# EAGLE design 1 (EAGLE 6.5.0)
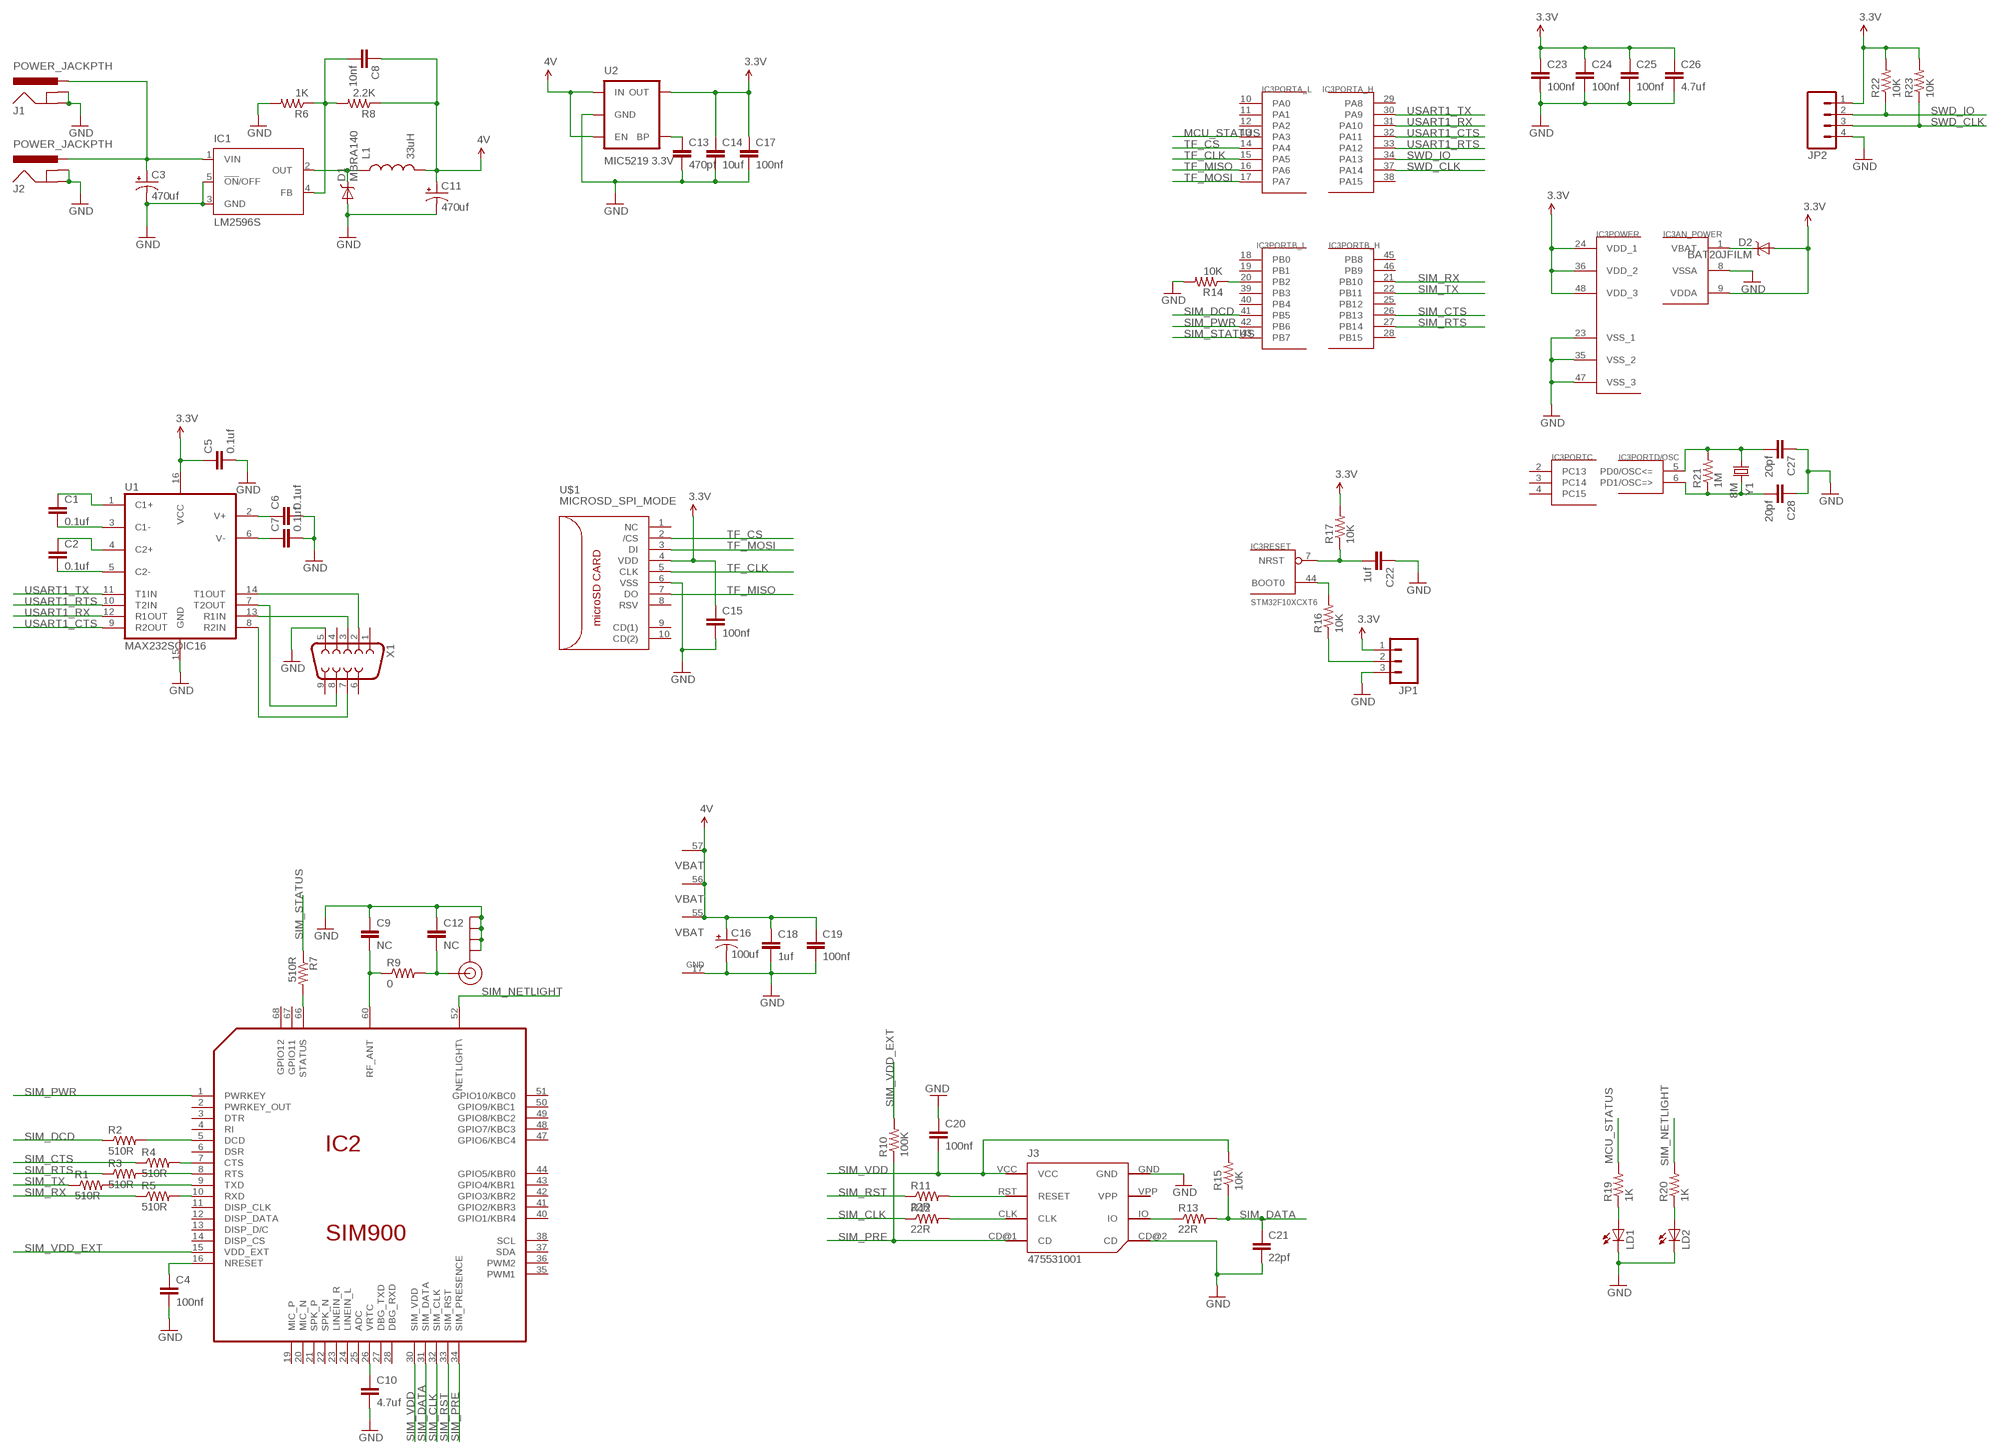
[diagram p0: schematic, sheet 1]

## Parts
C1  0.1uf  CAP0603-CAP  [0603-CAP]
C2  0.1uf  CAP0603-CAP  [0603-CAP]
C3  470uf  CAP_POLG  [PANASONIC_G]
C4  100nf  CAP0603-CAP  [0603-CAP]
C5  0.1uf  CAP0603-CAP  [0603-CAP]
C6  0.1uf  CAP0603-CAP  [0603-CAP]
C7  0.1uf  CAP0603-CAP  [0603-CAP]
C8  10nf  CAP0603-CAP  [0603-CAP]
C9  NC  CAP0603-CAP  [0603-CAP]
C10  4.7uf  CAP0603-CAP  [0603-CAP]
C11  470uf  CAP_POLG  [PANASONIC_G]
C12  NC  CAP0603-CAP  [0603-CAP]
C13  470pf  CAP0603-CAP  [0603-CAP]
C14  10uf  CAP0603-CAP  [0603-CAP]
C15  100nf  CAP0603-CAP  [0603-CAP]
C16  100uf  CAP_POL6032  [EIA6032]
C17  100nf  CAP0603-CAP  [0603-CAP]
C18  1uf  CAP0603-CAP  [0603-CAP]
C19  100nf  CAP0603-CAP  [0603-CAP]
C20  100nf  CAP0603-CAP  [0603-CAP]
C21  22pf  CAP0603-CAP  [0603-CAP]
C22  1uf  CAP0603-CAP  [0603-CAP]
C23  100nf  CAP0603-CAP  [0603-CAP]
C24  100nf  CAP0603-CAP  [0603-CAP]
C25  100nf  CAP0603-CAP  [0603-CAP]
C26  4.7uf  CAP0603-CAP  [0603-CAP]
C27  20pf  CAP0603-CAP  [0603-CAP]
C28  20pf  CAP0603-CAP  [0603-CAP]
D1  MBRA140  [SMA-DIODE]
D2  BAT20JFILM  [SOD-323]
IC1  LM2596S  [TO263-5]
IC2  SIM900  [SIM900]
IC3  STM32F10XCXT6  [TQFP48]
J1  POWER_JACKPTH  [POWER_JACK_PTH]
J2  POWER_JACKPTH  [POWER_JACK_PTH]
J3  475531001  [475531001]
J$1  SMA_EDGE  [SMA-EDGE]
JP1  M03PTH  [1X03]
JP2  M04PTH  [1X04]
L1  33uH  INDUCTOR68UH-1A  [CR75]
LD1  LEDCHIP-LED0805  [CHIP-LED0805]
LD2  LEDCHIP-LED0805  [CHIP-LED0805]
R1  510R  RESISTOR0603-RES  [0603-RES]
R2  510R  RESISTOR0603-RES  [0603-RES]
R3  510R  RESISTOR0603-RES  [0603-RES]
R4  510R  RESISTOR0603-RES  [0603-RES]
R5  510R  RESISTOR0603-RES  [0603-RES]
R6  1K  RESISTOR0603-RES  [0603-RES]
R7  510R  RESISTOR0603-RES  [0603-RES]
R8  2.2K  RESISTOR0603-RES  [0603-RES]
R9  0  1M-1%  [0603-RES]
R10  100K  1M-1%  [0603-RES]
R11  22R  1M-1%  [0603-RES]
R12  22R  1M-1%  [0603-RES]
R13  22R  1M-1%  [0603-RES]
R14  10K  1M-1%  [0603-RES]
R15  10K  1M-1%  [0603-RES]
R16  10K  RESISTOR0603-RES  [0603-RES]
R17  10K  RESISTOR0603-RES  [0603-RES]
R19  1K  RESISTOR0603-RES  [0603-RES]
R20  1K  RESISTOR0603-RES  [0603-RES]
R21  1M  1M-1%  [0603-RES]
R22  10K  1M-1%  [0603-RES]
R23  10K  1M-1%  [0603-RES]
U1  MAX232SOIC16  [SO016]
U2  MIC5219 3.3V  V_REG_MIC52193.3V  [SOT23-5]
U$1  MICROSD_SPI_MODE  [MICRO_SD_CONNECTOR]
X1  DB9FEMALE  [DB9]
Y1  8M  CRYSTALHC49US  [HC49US]

## Nets
3.3V: C5.1 C14.1 C15.1 C17.1 C23.1 C24.1 C25.1 C26.1 D2.2(A) IC3.9(AN_POWER:VDDA) IC3.24(POWER:VDD_1) IC3.36(POWER:VDD_2) IC3.48(POWER:VDD_3) JP1.1 JP2.1 R17.2 R22.2 R23.2 U1.16(VCC) U2.5(OUT) U$1.4(VDD)
GND: C3.- C4.2 C5.2 C6.2 C7.2 C9.1 C10.2 C11.- C12.1 C13.2 C14.2 C15.2 C16.P$2(-) C17.2 C18.2 C19.2 C20.1 C21.2 C22.1 C23.2 C24.2 C25.2 C26.2 C27.1 C28.1 D1.A IC1.3(GND) IC1.5(!ON!/OFF) IC2.17(GND) IC3.8(AN_POWER:VSSA) IC3.23(POWER:VSS_1) IC3.35(POWER:VSS_2) IC3.47(POWER:VSS_3) J1.GND J1.GNDBREAK J2.GND J2.GNDBREAK J3.CD@2(CD) J3.GND J$1.GND@0(GND) J$1.GND@1(GND) J$1.GND@2(GND) J$1.GND@3(GND) JP1.3 JP2.4 LD1.C LD2.C R6.2 R14.2 U1.15(GND) U2.2(GND) U$1.6(VSS) X1.5
MCU_STATUS: IC3.13(PORTA_L:PA3) R19.2
N$1: D2.1(C) IC3.1(AN_POWER:VBAT)
N$2: C27.2 IC3.5(PORTD/OSC:PD0/OSC<=) R21.2 Y1.1
N$3: C28.2 IC3.6(PORTD/OSC:PD1/OSC=>) R21.1 Y1.2
N$4: C22.2 IC3.7(RESET:NRST) R17.1
N$5: IC3.44(RESET:BOOT0) R16.2
N$6: JP1.2 R16.1
N$7: C3.+ IC1.1(VIN) J1.PWR J2.PWR
N$8: D1.C IC1.2(OUT) L1.P$1
N$9: C2.2 U1.5(C2-)
N$10: C1.2 U1.3(C1-)
N$11: C8.2 IC1.4(FB) R6.1 R8.2
N$12: C13.1 U2.4(BP)
N$13: C1.1 U1.1(C1+)
N$14: C2.1 U1.4(C2+)
N$15: C6.1 U1.2(V+)
N$16: C7.1 U1.6(V-)
N$17: IC3.20(PORTB_L:PB2) R14.1
N$18: U1.13(R1IN) X1.3
N$19: U1.14(T1OUT) X1.2
N$20: C9.2 IC2.60(RF_ANT) R9.1
N$21: C12.2 J$1.SIG(SIGNAL) R9.2
N$22: U1.7(T2OUT) X1.8
N$23: U1.8(R2IN) X1.7
N$24: J3.RST(RESET) R11.2
N$25: C10.1 IC2.26(VRTC)
N$26: LD1.A R19.1
N$27: LD2.A R20.1
N$29: C4.1 IC2.16(NRESET)
N$30: IC2.7(CTS) R4.2
N$33: IC2.8(RTS) R3.2
N$34: IC2.9(TXD) R1.2
N$35: J3.IO R13.1
N$36: IC2.10(RXD) R5.2
N$37: IC2.5(DCD) R2.2
N$38: IC2.66(STATUS) R7.2
N$39: J3.CLK R12.2
SIM_CLK: IC2.32(SIM_CLK) R12.1
SIM_CTS: IC3.26(PORTB_H:PB13) R4.1
SIM_DATA: C21.1 IC2.31(SIM_DATA) R13.2 R15.1
SIM_DCD: IC3.41(PORTB_L:PB5) R2.1
SIM_NETLIGHT: IC2.52(NETLIGHT\) R20.2
SIM_PRE: IC2.34(SIM_PRESENCE) J3.CD@1(CD) R10.1
SIM_PWR: IC2.1(PWRKEY) IC3.42(PORTB_L:PB6)
SIM_RST: IC2.33(SIM_RST) R11.1
SIM_RTS: IC3.27(PORTB_H:PB14) R3.1
SIM_RX: IC3.21(PORTB_H:PB10) R5.1
SIM_STATUS: IC3.43(PORTB_L:PB7) R7.1
SIM_TX: IC3.22(PORTB_H:PB11) R1.1
SIM_VDD: C20.2 IC2.30(SIM_VDD) J3.VCC R15.2
SIM_VDD_EXT: IC2.15(VDD_EXT) R10.2
SWD_CLK: IC3.37(PORTA_H:PA14) JP2.3 R23.1
SWD_IO: IC3.34(PORTA_H:PA13) JP2.2 R22.1
TF_CLK: IC3.15(PORTA_L:PA5) U$1.5(CLK)
TF_CS: IC3.14(PORTA_L:PA4) U$1.2(/CS)
TF_MISO: IC3.16(PORTA_L:PA6) U$1.7(DO)
TF_MOSI: IC3.17(PORTA_L:PA7) U$1.3(DI)
USART1_CTS: IC3.32(PORTA_H:PA11) U1.9(R2OUT)
USART1_RTS: IC3.33(PORTA_H:PA12) U1.10(T2IN)
USART1_RX: IC3.31(PORTA_H:PA10) U1.12(R1OUT)
USART1_TX: IC3.30(PORTA_H:PA9) U1.11(T1IN)
VCC: C8.1 C11.+ C16.P$1(+) C18.1 C19.1 IC2.55(VBAT) IC2.56(VBAT) IC2.57(VBAT) L1.P$2 R8.1 U2.1(IN) U2.3(EN) ; supply symbol labelled 4V
Unconnected: IC2.2(PWRKEY_OUT) IC2.3(DTR) IC2.4(RI) IC2.6(DSR) IC2.11(DISP_CLK) IC2.12(DISP_DATA) IC2.13(DISP_D/C) IC2.14(DISP_CS) IC2.19(MIC_P) IC2.20(MIC_N) IC2.21(SPK_P) IC2.22(SPK_N) IC2.23(LINEIN_R) IC2.24(LINEIN_L) IC2.25(ADC) IC2.27(DBG_TXD) IC2.28(DBG_RXD) IC2.35(PWM1) IC2.36(PWM2) IC2.37(SDA) IC2.38(SCL) IC2.40(GPIO1/KBR4) IC2.41(GPIO2/KBR3) IC2.42(GPIO3/KBR2) IC2.43(GPIO4/KBR1) IC2.44(GPIO5/KBR0) IC2.47(GPIO6/KBC4) IC2.48(GPIO7/KBC3) IC2.49(GPIO8/KBC2) IC2.50(GPIO9/KBC1) IC2.51(GPIO10/KBC0) IC2.67(GPIO11) IC2.68(GPIO12) IC3.2(PORTC:PC13) IC3.3(PORTC:PC14) IC3.4(PORTC:PC15) IC3.10(PORTA_L:PA0) IC3.11(PORTA_L:PA1) IC3.12(PORTA_L:PA2) IC3.18(PORTB_L:PB0) IC3.19(PORTB_L:PB1) IC3.25(PORTB_H:PB12) IC3.28(PORTB_H:PB15) IC3.29(PORTA_H:PA8) IC3.38(PORTA_H:PA15) IC3.39(PORTB_L:PB3) IC3.40(PORTB_L:PB4) IC3.45(PORTB_H:PB8) IC3.46(PORTB_H:PB9) J3.VPP U$1.1(NC) U$1.8(RSV) U$1.9(CD(1)) U$1.10(CD(2)) X1.1 X1.4 X1.6 X1.9

## Power pins joined to a net without a drawn wire
GND: IC2.18(GND) IC2.29(GND) IC2.39(GND) IC2.45(GND) IC2.46(GND) IC2.53(GND) IC2.54(GND) IC2.58(GND) IC2.59(GND) IC2.61(GND) IC2.62(GND) IC2.63(GND) IC2.64(GND) IC2.65(GND)

## Library data of the parts
C1 C2 C4-C10 C12-C15 C17-C28 = SparkFun-Passives:CAP: Capacitor Standard 0603 ceramic capacitor, and 0.1" leaded capacitor.
C3 C11 = SparkFun-Capacitors:CAP_POL: Capacitor Polarized These are standard SMD and PTH capacitors. Normally 10uF, 47uF, and 100uF in electrolytic and tantalum varieties. Always verify the external diameter of the through hole cap, it varies with capacity, voltage, and manufacturer. The EIA devices should be standard.
C16 = SparkFun-Passives:CAP_POL: Capacitor Polarized These are standard SMD and PTH capacitors. Normally 10uF, 47uF, and 100uF in electrolytic and tantalum varieties. Always verify the external diameter of the through hole cap, it varies with capacity, voltage, and manufacturer. The EIA devices should be standard.
D1 = SparkFun-DiscreteSemi:MBRA140: 40V, 1A Schottky rectifier SMA/DO-214AC package DIO-08053; PROD_ID: DIO-08053
D2 = SparkFun-DiscreteSemi:BAT20JFILM: 23V, 1A Schottky diode, SOD-323 package; PROD_ID: DIO-11623
IC1 = national-semiconductor:LM2596: SIMPLE SWITCHER® Power Converter 150 kHz 3A Step-Down Voltage Regulator Source: http://www.national.com/ds/LM/LM2596.pdf
IC2 = sim900:SIM900
IC3 = stm32:STM32F10XCXT6: ST STM32F101/103 48pin LQFP
J1 J2 = SparkFun-Connectors:POWER_JACK: Power Jack This is the standard 5.5mm barrel jack for power. The PTH is the most common, proven, reliable, footprint. The Slot footprint only works if the mill layer is transmitted to the PCB fab house so be warned. Mating wall wart : TOL-00298 (and others); PROD_ID: PRT-00119
J3 = simcard:475531001: MOLEX SIM Card Holder 47553-1001 1.27mm Pitch SIM Card Holder with 2 Detect Pins, 6 Circuits, Push-Push Style, Housing Height 1.80mm, with Pegs, Lead-Free
J$1 = SparkFun-Connectors:SMA_EDGE: SMA Antenna Connector End launch SMA connector. The paste layer has been removed so that the connector can be hand soldered onto the board after reflow.
JP1 = SparkFun-Connectors:M03: Header 3 Standard 3-pin 0.1" header. Use with straight break away headers (SKU : PRT-00116), right angle break away headers (PRT-00553), swiss pins (PRT-00743), machine pins (PRT-00117), and female headers (PRT-00115). Molex polarized connector foot print use with SKU : PRT-08232 with associated crimp pins and housings.
JP2 = SparkFun-Connectors:M04: Header 4 Standard 4-pin 0.1" header. Use with straight break away headers (SKU : PRT-00116), right angle break away headers (PRT-00553), swiss pins (PRT-00743), machine pins (PRT-00117), and female headers (PRT-00115). Molex polarized connector foot print use with SKU : PRT-08231 with associated crimp pins and housings. 1MM SMD Version SKU: PRT-10208
L1 = SparkFun-Passives:INDUCTOR: Inductors Basic Inductor/Choke - 0603 and 1206. Footprints are not proven and vary greatly between part numbers. SRN6045- 33uH, 20% 1.4A SDR0403-560KL - 56uH, 10%, 500mA RMS/740mA peak; PROD_ID: NDUC-09739; VALUE: 68uH
LD1 LD2 = led:LED: LED OSRAM: - CHIPLED LG R971, LG N971, LY N971, LG Q971, LY Q971, LO R971, LY R971 LH N974, LH R974 LS Q976, LO Q976, LY Q976 LO Q996 - Hyper CHIPLED LW Q18S LB Q993, LB Q99A, LB R99A - SideLED LS A670, LO A670, LY A670, LG A670, LP A670 LB A673, LV A673, LT A673, LW A673 LH A674 LY A675 LS A676, LA A676, LO A676, LY A676, LW A676 LS A679, LY A679, LG A679 - Hyper Micro SIDELED® LS Y876, LA Y876, LO Y876, LY Y876 LT Y87S - SmartLED LW L88C, LW L88S LB L89C, LB L89S, LG L890 LS L89K, LO L89K, LY L89K LS L896, LA L896, LO L896, LY L896 - TOPLED LS T670, LO T670, LY T670, LG T670, LP T670 LSG T670, LSP T670, LSY T670, LOP T670, LYG T670 LG T671, LOG T671, LSG T671 LB T673, LV T673, LT T673, LW T673 LH T674 LS T676, LA T676, LO T676, LY T676, LB T676, LH T676, LSB T676, LW T676 LB T67C, LV T67C, LT T67C, LS T67K, LO T67K, LY T67K, LW E67C LS E67B, LA E67B, LO E67B, LY E67B, LB E67C, LV E67C, LT E67C LW T67C LS T679, LY T679, LG T679 LS T770, LO T770, LY T770, LG T770, LP T770 LB T773, LV T773, LT T773, LW T773 LH T774 LS E675, LA E675, LY E675, LS T675 LS T776, LA T776, LO T776, LY T776, LB T776 LHGB T686 LT T68C, LB T68C - Hyper Mini TOPLED® LB M676 - Mini TOPLED Santana® LG M470 LS M47K, LO M47K, LY M47K Source: http://www.osram.convergy.de/
R1-R8 R16 R17 R19 R20 = SparkFun-Passives:RESISTOR: Resistor Basic schematic elements and footprints for 0603, 1206, and PTH resistors.
R9-R15 R22 R23 = SparkFun-Resistors:1M-1%: 1M-ohm SMT 1/10W - 1% (0603) RES-07868; PROD_ID: RES-07868; VALUE: 1M
R21 = SparkFun-Resistors:1M-1%: 1M-ohm SMT 1/10W - 1% (0603) RES-07868; PROD_ID: RES-07868
U1 = SparkFun-DigitalIC:MAX232: RS232 Transceiver Very common IC. This is generically called 'MAX232', but works with the 3V equivalent MAX3232 generic ICs. Field tested and mother approved. Spark Fun Electronics SKU : COM-00316 (DIP) and COM-00589 (SMD)
U2 = SparkFun-PowerIC:V_REG_MIC5219: V_REG MIC5219 Standard 3.3V and 5V 500mA LDO voltage regulator in SOT-23 layout. Micrel part MIC5219. BP (by-pass) pin is used to lower output noise with 470pF cap, may be left open.; PROD_ID: VREG-09872
U$1 = con-molex-microsd:MICROSD_SPI_MODE: MOLEX - 49225-0821 - CONNECTEUR MICRO SD PUSH/PUSH REV Fabricant: MOLEX Code commande Farnell: 1366700 <http://fr.farnell.com/molex/49225-0821/connecteur-micro-sd-push-push-rev/dp/1366700?Ntt=1366700> Référence fabricant: 49225-0821
X1 = SparkFun-Connectors:DB9: DB9 Connector Standard DB9 (D-Sub 9) serial connector. Can be used for CAN bus as well as RS485 and RS232. Footprint production proven. Spark Fun Electronics SKU : PRT-00429
Y1 = SparkFun-FreqCtrl:CRYSTAL: Various standard crystals. Proven footprints. Spark Fun Electronics SKU : COM-00534

## Board
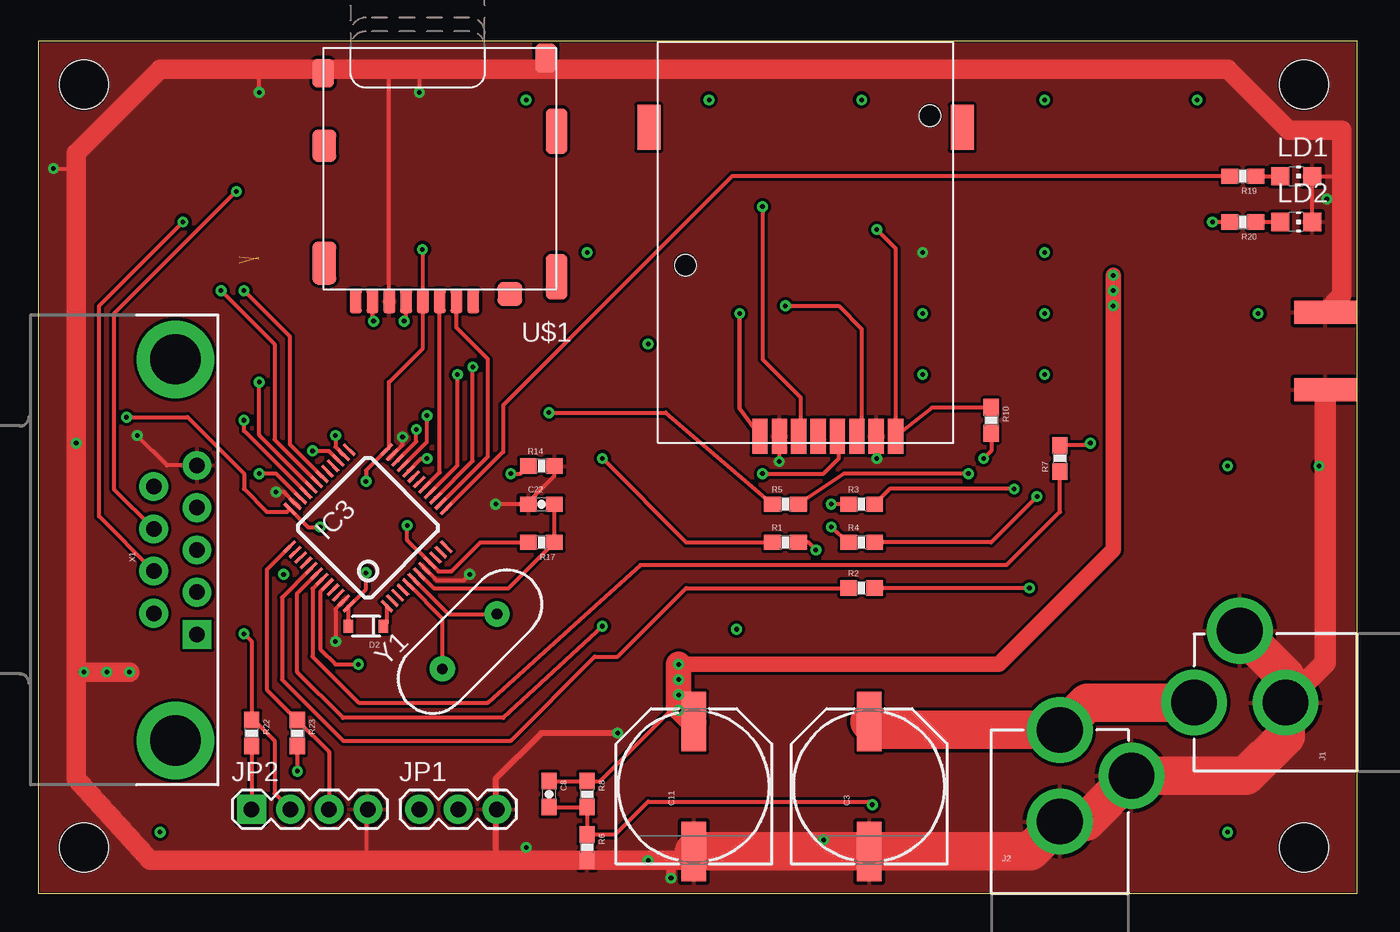
[diagram p1: board, top side]
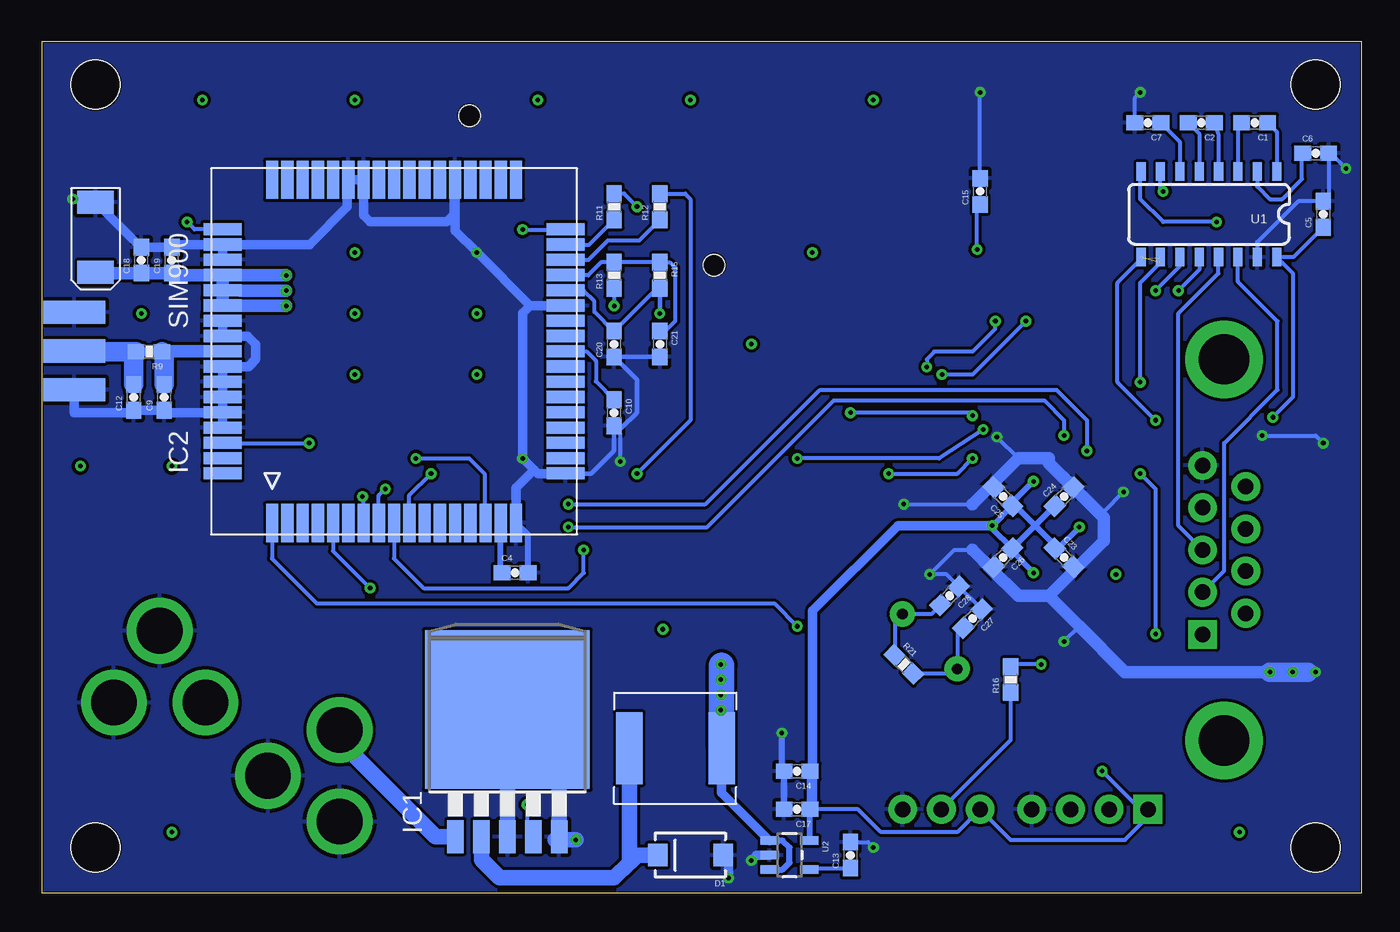
[diagram p2: board, bottom side, seen from below]

Size 86.5 x 55.83 mm. Coordinates in mm from the lower left corner, seen from the top.
Outline: 0,0 86.5,0 86.5,55.83 0,55.83 0,0
Copper layers (1*16): Top 0.035mm / dielectric 1.5mm / Bottom 0.035mm
Design rules "default *": minimum track width 10mil, minimum drill 14mil, track to track 8mil, track to pad 8mil, pad to pad 8mil, via to via 8mil, smd to smd 8mil, copper to edge 0.1mm, drill to drill 8mil, minimum pad ring 10mil, minimum via ring 8mil, stop-mask expansion 4mil, vias tented up to drill 0mil, thermal gap 10mil
Holes 3.2 mm at 83,3 83,53 3,53 3,3

### Footprints (pad centres in the part's own frame; a part is rotated, then mirrored left to right if it is on the bottom)
0603-CAP = smd 1.1 x 1: 1 -0.85,0; 2 0.85,0
PANASONIC_G = smd 3.9 x 1.6: + 4.25,0; - -4.25,0
EIA6032 = smd 1.5 x 2.4: P$1 -2.3,0; P$2 2.3,0
SMA-DIODE = smd 1.27 x 1.47: A -2.15,0; C 2.15,0
SOD-323 = smd 0.63 x 0.83: 1 -1.15,0; 2 1.15,0
TO263-5 = smd 1.067 x 2.159: 1 -3.404,-5.791; 2 -1.702,-5.791; 3 0,-5.791; 4 1.702,-5.791; 5 3.404,-5.791 | smd 10.8 x 10.41: 6 0,2.54
SIM900 = smd 2.5 x 0.8: 1 -11.25,8; 2 -11.25,7; 3 -11.25,6; 4 -11.25,5; 5 -11.25,4; 6 -11.25,3; 7 -11.25,2; 8 -11.25,1; 9 -11.25,0; 10 -11.25,-1; 11 -11.25,-2; 12 -11.25,-3; 13 -11.25,-4; 14 -11.25,-5; 15 -11.25,-6; 16 -11.25,-7; 17 -11.25,-8; 35 11.25,-8; 36 11.25,-7; 37 11.25,-6; 38 11.25,-5; 39 11.25,-4; 40 11.25,-3; 41 11.25,-2; 42 11.25,-1; 43 11.25,0; 44 11.25,1; 45 11.25,2; 46 11.25,3; 47 11.25,4; 48 11.25,5; 49 11.25,6; 50 11.25,7; 51 11.25,8 | smd 0.8 x 2.5: 18 -8,-11.25; 19 -7,-11.25; 20 -6,-11.25; 21 -5,-11.25; 22 -4,-11.25; 23 -3,-11.25; 24 -2,-11.25; 25 -1,-11.25; 26 0,-11.25; 27 1,-11.25; 28 2,-11.25; 29 3,-11.25; 30 4,-11.25; 31 5,-11.25; 32 6,-11.25; 33 7,-11.25; 34 8,-11.25; 52 8,11.25; 53 7,11.25; 54 6,11.25; 55 5,11.25; 56 4,11.25; 57 3,11.25; 58 2,11.25; 59 1,11.25; 60 0,11.25; 61 -1,11.25; 62 -2,11.25; 63 -3,11.25; 64 -4,11.25; 65 -5,11.25; 66 -6,11.25; 67 -7,11.25; 68 -8,11.25
TQFP48 = smd 0.2 x 1: 1 -2.75,-4.5; 2 -2.25,-4.5; 3 -1.75,-4.5; 4 -1.25,-4.5; 5 -0.75,-4.5; 6 -0.25,-4.5; 7 0.25,-4.5; 8 0.75,-4.5; 9 1.25,-4.5; 10 1.75,-4.5; 11 2.25,-4.5; 12 2.75,-4.5; 25 2.75,4.5; 26 2.25,4.5; 27 1.75,4.5; 28 1.25,4.5; 29 0.75,4.5; 30 0.25,4.5; 31 -0.25,4.5; 32 -0.75,4.5; 33 -1.25,4.5; 34 -1.75,4.5; 35 -2.25,4.5; 36 -2.75,4.5 | smd 1 x 0.2: 13 4.5,-2.75; 14 4.5,-2.25; 15 4.5,-1.75; 16 4.5,-1.25; 17 4.5,-0.75; 18 4.5,-0.25; 19 4.5,0.25; 20 4.5,0.75; 21 4.5,1.25; 22 4.5,1.75; 23 4.5,2.25; 24 4.5,2.75; 37 -4.5,2.75; 38 -4.5,2.25; 39 -4.5,1.75; 40 -4.5,1.25; 41 -4.5,0.75; 42 -4.5,0.25; 43 -4.5,-0.25; 44 -4.5,-0.75; 45 -4.5,-1.25; 46 -4.5,-1.75; 47 -4.5,-2.25; 48 -4.5,-2.75
POWER_JACK_PTH = drill 2.997 pad 4.318: GND 0,7.7; GNDBREAK 4.7,10.7; PWR 0,13.7
475531001 = smd 2.3 x 1: CD@1 0.45,3.77; CD@2 0.45,5.04; CLK 0.45,7.58; GND 0.45,11.39; IO 0.45,6.31; RST 0.45,10.12; VCC 0.45,12.66; VPP 0.45,8.85 | smd 2.95 x 1.5: P$9 20.7,-0.6; P$10 20.7,19.95 | hole 1.4: 11.67,17.56; 21.47,1.51
SMA-EDGE = smd 1.524 x 4.064: GND@0 0,0; GND@1 5.08,0; SIG 2.54,0 | smd 1.524 x 4.064 bottom: GND@2 0,0; GND@3 5.08,0
1X03 = drill 1.016 pad 1.88: 1 0,0; 2 2.54,0; 3 5.08,0
1X04 = drill 1.016 pad 1.88 square: 1 0,0 | drill 1.016 pad 1.88: 2 2.54,0; 3 5.08,0; 4 7.62,0
CR75 = smd 1.75 x 4.7: P$1 0,0; P$2 6.05,0
CHIP-LED0805 = smd 1.2 x 1.2: A 0,-1.05; C 0,1.05
0603-RES = smd 1.1 x 1: 1 -0.85,0; 2 0.85,0
SO016 = smd 0.6 x 1.2: 1 -4.445,-2.8; 2 -3.175,-2.8; 3 -1.905,-2.8; 4 -0.635,-2.8; 5 0.635,-2.8; 6 1.905,-2.8; 7 3.175,-2.8; 8 4.445,-2.8; 9 4.445,2.8; 10 3.175,2.8; 11 1.905,2.8; 12 0.635,2.8; 13 -0.635,2.8; 14 -1.905,2.8; 15 -3.175,2.8; 16 -4.445,2.8
SOT23-5 = smd 0.55 x 1.2: 1 -0.95,-1.3; 2 0,-1.3; 3 0.95,-1.3; 4 0.95,1.3; 5 -0.95,1.3
MICRO_SD_CONNECTOR = smd 0.8 x 1.6: 1 -2.03,8.2; 2 -0.93,8.2; 3 0.17,8.2; 4 1.27,8.2; 5 2.37,8.2; 6 3.47,8.2; 7 4.57,8.2; 8 5.67,8.2 | smd 1.55 x 2.8: 9 7.735,5.7 | smd 1.55 x 2.1: 10 7.735,-2 | smd 1.4 x 1.9: 11 7.81,-6.75; 12 -6.79,-7.75 | smd 1.4 x 3: 13 -7.49,-2.95; 14 -7.49,6.6 | smd 1.6 x 1.55: 15 -4.43,7.725
DB9 = drill 1.016 pad 1.88 square: 1 -5.54,-1.42 | drill 1.016 pad 1.88: 2 -2.77,-1.42; 3 0,-1.42; 4 2.77,-1.42; 5 5.54,-1.42; 6 -4.15,1.42; 7 -1.38,1.42; 8 1.38,1.42; 9 4.15,1.42 | drill 3.302 pad 5.08: G1 -12.5,0; G2 12.5,0
HC49US = drill 0.7 pad 1.651: 1 -2.54,0; 2 2.54,0

### Placement (x,y rotation side)
C1  7,50.5 180 bottom
C2  10.5,50.5 180 bottom
C3  54.5,7 90 top
C4  55.5,21 0 bottom
C5  2.5,44.5 90 bottom
C6  3,48.5 0 bottom
C7  14,50.5 180 bottom
C8  33.5,6.5 270 top
C9  78.5,32.5 90 bottom
C10  49,31.5 270 bottom
C11  43,7 90 top
C12  80.5,32.5 90 bottom
C13  33.5,2.5 90 bottom
C14  37,8 180 bottom
C15  25,46 90 bottom
C16  83,43 90 bottom
C17  37,5.5 180 bottom
C18  80,41.5 90 bottom
C19  78,41.5 90 bottom
C20  49,36 90 bottom
C21  46,36 270 bottom
C22  33,25.5 0 top
C23  19.5,22 315 bottom
C24  19.5,26 45 bottom
C25  23.5,26 135 bottom
C26  23.5,22 225 bottom
C27  25.5,18 225 bottom
C28  27,19.5 225 bottom
D1  44,2.5 180 bottom
D2  21.5,17.5 180 top
IC1  56,9.5 0 bottom
IC2  63.43,35.52 90 bottom
IC3  21.63,23.95 45 top
J1  89.5,12.5 90 top
J2  67,-3 0 top
J3  60,29.5 90 top
J$1  84.4,33 90 bottom
JP1  25,5.5 0 top
JP2  14,5.5 0 top
L1  48,9.5 0 bottom
LD1  82.5,47 270 top
LD2  82.5,44 270 top
R1  49,23 0 top
R2  54,20 0 top
R3  54,25.5 0 top
R4  54,23 0 top
R5  49,25.5 0 top
R6  36,3 270 top
R7  67,28.5 90 top
R8  36,6.5 270 top
R9  79.5,35.5 180 bottom
R10  62.5,31 270 top
R11  49,45 90 bottom
R12  46,45 90 bottom
R13  49,40.5 90 bottom
R14  33,28 0 top
R15  46,40.5 270 bottom
R16  23,14 90 bottom
R17  33,23 180 top
R19  79,47 180 top
R20  79,44 180 top
R21  30,15 315 bottom
R22  14,10.5 270 top
R23  17,10.5 270 top
U1  10,44.5 180 bottom
U2  37.5,2.5 270 bottom
U$1  26.5,47 180 top
X1  9,22.5 90 top
Y1  28.3,16.5 45 top

### Tracks (layer width: path | path; a pad name or v marks a point on that pad's centre or on a via)
3.3V  (via drill 0.3)
  Top 0.254: v18.5,24 17.69,24 IC3.36 16.32,25 15,25 13.5,26.5 13.5,27.5 9.8,31.2 v5.8,31.2 | v21.5,27 21.5,27.71 IC3.24 23,29.21 23,33.5 25.23,35.73 U$1.4 25.23,42.17 v25.2,42.2 | v24.2,24.1 24.2,23.15 IC3.9 26.25,21.1 27.1,21.1 29,23 R17.2 | D2.2 20.35,18.78 IC3.48 21.5,19.93 v21.5,21 | R22.2 JP2.1 | R23.2 v17,8
  Bottom 0.254: C5.1 4.45,41.7 U1.16 4.5,40.65 4.5,32.5 v5.8,31.2 | 22.9,25.6 C25.1 | v25.2,42.2 25.2,44.95 C15.1 | 22.9,22.4 C26.1 | C17.1 33,5.5 31.5,4 26.5,4 JP1.1 23,3.5 15.5,3.5 14,5 JP2.1 14.5,5.5 v17,8
  Bottom 0.406: U2.5 36.15,3.5 C17.1 C14.1 | C24.1 C26.1 24.2,23.9 v24.2,24.1 C25.1 | v18.5,24 19.9,22.6 | v21.5,21 22.9,22.4 | 19.9,22.6 22.7,25.4 C25.1 22.9,25.1 23,25 23,25.5 v21.5,27 | 19.9,22.6 C23.1
  Bottom 0.61: C17.1 36,5.65 36,18.5 30.4,24.1 v24.2,24.1
GND  (via drill 0.3)
  Top 0.254: 19.08,2.23 19,2.15 | X1.5 8.46,28.04 v6.5,30 | JP2.4 21.5,5.38 21.5,2.15 | v14.5,52.5 14.5,54 | U$1.6 23,39.33 23,54 | v25,52.5 25,54 | IC3.8 26.14,20.5 27.9,20.5 v28.3,20.9 | IC3.23 23.9,29.4 v23.9,29.9 | v32,3 32,2.5 32,2.15 | IC3.47 19.5,18.64 v19.5,16.5 | IC3.35 16.1,26.3 v15.6,26.3 | v30,25.5 C22.1 32.15,25.65 33.85,27.35 R14.2 | LD2.C LD1.C 85,47 85.5,47.5 | v84.5,45.5 85.5,45.5 | v55,28.5 54.96,28.54 J3.CD@2 | v48.6,28.3 v48.61,28.31 J3.GND | v1,47.5 2.5,47.5
  Top 0.406: v38,10.5 33,10.5 30,7.5 30,5.58 JP1.3 | 30,5.5 30,2 32,2 32,2.5
  Top 0.61: v41.5,1 41.5,2.15
  Top 0.813: v3,14.5 2.5,14.5
  Top 1.016: v51.5,3.5 51.5,2.75
  Top 1.27: C11.- 42.4,2.15 41.5,2.15 v40,2.15 R6.2 32,2.15 21.5,2.15 19,2.15 7.35,2.15 2.5,7.5 2.5,14.5 v2.5,29.5 2.5,47.5 2.5,48.5 8,54 14.5,54 23,54 25,54 78,54 82,50 85.5,50 85.5,47.5 85.5,45.5 85.5,39.18 J$1.GND@1 | v6,14.5 v3,14.5
  Top 1.422: J$1.GND@0 84.4,15.1 J1.GND
  Top 2.54: C11.- 51.5,2.75 C3.- 65.05,2.75 J2.GND 68.7,4.7 J2.GNDBREAK 79.2,7.7 81.8,10.3 J1.GND 81.8,14.2 J1.GNDBREAK
  Bottom 0.254: C27.1 C28.1 27.2,20.9 v28.3,20.9 26.7,22.5 25.5,22.5 24.95,21.95 24.95,21.75 24.75,21.75 | v6.5,30 3,30 v2.5,29.5 | C23.2 19,21.3 19,21 | C24.2 | C25.2 24,26.7 24,27 | C26.2 24.25,21.25 | U1.15 6.83,42.67 4.15,45.35 C5.2 2.15,45.7 C6.2 2,48.5 v1,47.5 | C15.2 v25,52.5 | v23.9,29.9 22.5,28.5 | C13.2 32.35,3.35 v32,3 | v19.5,16.5 18.5,17.5 | v15.6,26.3 16.9,25 16.9,24.6 | v30,25.5 25.5,25.5 | C16.P$2 84.2,45.3 v84.5,45.5 | 48.5,30.5 49,30.5 48.6,30.1 v48.6,28.3 | C7.2 14.85,52.15 v14.5,52.5
  Bottom 0.305: C21.2 C20.1 47.5,33.65 47.5,31.5 48.5,30.5 48.85,30.5 C10.2 49,30.5 49,29 50.5,27.5 52.16,27.5 IC2.18
  Bottom 0.406: C14.2 C17.2 37.85,7.85 38,8 v38,10.5 | C4.2 54.65,23.49 IC2.17
  Bottom 0.61: U2.2 39.65,2.5 v40,2.15 | D1.A 41.5,2.15 v41.5,1 | IC2.65 IC2.64 | IC2.64 74.81,31.65 74.96,31.5 78.35,31.5 C9.1 C12.1 80.65,31.5 84.4,31.5 84.4,32.5 | IC2.64 IC2.63 IC2.62 IC2.61 72.98,34.52 72.5,35 72.5,36 73.02,36.52 IC2.59 IC2.58 | IC2.53 IC2.54 | IC2.53 77.83,42.52 C19.2 C18.2 80.05,42.35 C16.P$2 | IC2.53 68.98,42.52 66.5,45 66.5,46.7 IC2.46 IC2.45 65.43,44.43 65,44 60,44 59.5,44.5 59.5,46.7 IC2.39 59.43,43.43 v58,42 54.5,38.5 | IC2.29 52.2,38.5 54.5,38.5 | 54.5,38.5 55,38 v55,28.5 54.25,27.75 | 54.25,27.75 54,27.5 52.2,27.5 IC2.18 | IC2.17 55.43,26.57 54.25,27.75
  Bottom 0.813: 25.5,22.5 24.75,21.75 24.25,21.25 22.5,19.5 20.5,19.5 | 25.5,25.5 24,27 22.5,28.5 20.5,28.5 20.5,28.2 20.4,28.1 | 20.5,19.5 19,21 16.9,23.1 16.9,24.6 20.4,28.1 | v6,14.5 15.5,14.5 18.5,17.5 20.5,19.5 | C24.2 20.4,28.1
  Bottom 1.016: 56.5,8.5 56,8.5 | 56,8.5 53,8.5 53.1,8.4 52.6,7.9 IC1.5 52.89,3.5 v51.5,3.5 | IC1.3 56,8.5
  Bottom 1.27: v6,14.5 3.5,14.5
  other vias: 4.5,14.5
  pour Bottom: 0,56 0,0 86.5,0 86.5,56
  pour Top: 0,56 0,0 86.5,0 86.5,56
MCU_STATUS
  Top 0.254: R19.2 45.5,47 30.5,32 30.5,28.93 IC3.13
N$1
  Top 0.254: IC3.1 22.87,17.72 D2.1
N$2
  Top 0.254: IC3.5 26.5,18.02 Y1.1
  Bottom 0.254: R21.2 26.81,14.4 Y1.1 26.5,17.4 C27.2
N$3
  Top 0.254: IC3.6 26.93,18.3 Y1.2
  Bottom 0.254: R21.1 30.6,17.79 Y1.2 28.2,18.3 C28.2
N$4
  Top 0.254: IC3.7 25.93,20 30.85,20 R17.1 C22.2
N$5  (via drill 0.3)
  Top 0.254: IC3.44 18.5,19.76 18.5,16 19.5,15 v21,15
  Bottom 0.254: v21,15 22.85,15 R16.2
N$6
  Top 0.254: JP1.2 27.5,5.54
  Bottom 0.254: R16.1 23,10.04 JP1.2
N$7
  Top 2.54: C3.+ 55.05,10.7 J2.PWR 68.8,12.5 J1.PWR
  Bottom 1.016: IC1.1 60.71,3.71 66.5,9.5 66.5,10.2 J2.PWR
N$8
  Bottom 1.016: 48,2 49,1 56.5,1 57.7,2.2 IC1.2 | 48,2 L1.P$1 | D1.C 47.5,2.5 48,2
N$9
  Bottom 0.254: C2.2 10.63,49.78 U1.5
N$10
  Bottom 0.254: C1.2 8.1,50.24 U1.3
N$11  (via drill 0.3)
  Top 0.254: C8.2 R8.2 R6.1 37.85,3.85 40,6 54.5,6 v54.7,5.8
  Bottom 0.254: v54.7,5.8 54.7,3.81 IC1.4
N$12
  Bottom 0.254: U2.4 36.1,1.65 C13.1
N$13
  Bottom 0.254: C1.1 5.55,49.91 U1.1
N$14
  Bottom 0.254: C2.1 9.37,49.72 U1.4
N$15
  Bottom 0.254: U1.2 6.83,46.33 6,45.5 5.2,45.5 3.9,46.8 3.9,48.45 C6.1
N$16
  Bottom 0.254: C7.1 11.9,49.26 U1.6
N$17  (via drill 0.3)
  Top 0.254: v31,27.5 31.65,27.5 R14.1 | IC3.20 25.12,28.5 v25.5,28.5
  Bottom 0.254: v31,27.5 26.5,27.5 v25.5,28.5
N$18
  Bottom 0.254: X1.3 12,24.08 12,38 9.37,40.63 U1.13
N$19
  Bottom 0.254: X1.2 9,21.15 9,29.5 5.5,33 5.5,37.5 8.1,40.09 U1.14
N$20
  Bottom 0.813: IC2.60 78.63,35.52 R9.1
  Bottom 1.27: C9.2 78.5,35.35 R9.1
N$21
  Bottom 1.27: J$1.SIG 84.36,35.5 R9.2 80.5,35.35 C12.2
N$22  (via drill 0.3)
  Top 0.254: X1.8 5,26.46 5,38 v13,46
  Bottom 0.254: v13,46 13.18,46.17 U1.7
N$23  (via drill 0.3)
  Top 0.254: X1.7 4,24.7 4,38.5 v9.5,44
  Bottom 0.254: v9.5,44 13,44 14.5,45.5 14.5,47.24 U1.8
N$24  (via drill 0.3)
  Top 0.254: v47.5,45 47.5,35 50,32.5 50,30.07 J3.RST
  Bottom 0.254: v47.5,45 48.35,45.85 R11.2
N$25
  Bottom 0.254: IC2.26 50.82,35.52 50.2,34.9 50.2,33.55 C10.1
N$26
  Top 0.254: R19.1 LD1.A
N$27
  Top 0.254: R20.1 LD2.A
N$28  (via drill 0.3)
  other vias: 32,52
N$29
  Bottom 0.406: C4.1 56.43,21 IC2.16
N$30  (via drill 0.3)
  Top 0.254: v65.5,26 62.5,23 R4.2
  Bottom 0.254: IC2.7 65.43,25.93 v65.5,26
N$31  (via drill 0.3)
  other vias: 42,12
N$32  (via drill 0.3)
  other vias: 44,52
N$33  (via drill 0.3)
  Top 0.254: v64,26.5 55.85,26.5 R3.2
  Bottom 0.254: IC2.8 64.43,26.07 v64,26.5
N$34  (via drill 0.3)
  Top 0.254: v51,22.5 50.5,23 R1.2
  Bottom 0.254: IC2.9 63.43,21.93 61.5,20 52,20 51,21 v51,22.5
N$35  (via drill 0.3)
  Top 0.254: v49,38.5 52.5,38.5 54,37 54,30.14 J3.IO
  Bottom 0.254: R13.1 v49,38.5
N$36  (via drill 0.3)
  Top 0.254: v61,27.5 52.85,27.5 R5.2
  Bottom 0.254: IC2.10 62.43,26.07 v61,27.5
N$37  (via drill 0.3)
  Top 0.254: v65,20 R2.2
  Bottom 0.254: IC2.5 67.43,22.43 v65,20
N$38  (via drill 0.3)
  Top 0.254: v69,29.5 68.85,29.35 R7.2
  Bottom 0.254: IC2.66 74.66,29.5 v69,29.5
N$39  (via drill 0.3)
  Top 0.254: v47.5,27.5 51.5,27.5 52.5,28.5 52.5,29.87 J3.CLK
  Bottom 0.254: R12.2 44.35,45.85 44,45.5 44,31 v47.5,27.5
N$40  (via drill 0.3)
  other vias: 54,52
N$41  (via drill 0.3)
  other vias: 66,52
N$42  (via drill 0.3)
  other vias: 76,52
N$43  (via drill 0.3)
  other vias: 66,42
N$44  (via drill 0.3)
  other vias: 58,38
N$45  (via drill 0.3)
  other vias: 66,38
N$46  (via drill 0.3)
  other vias: 58,34
N$47  (via drill 0.3)
  other vias: 66,34
N$48  (via drill 0.3)
  other vias: 80,38
N$49  (via drill 0.3)
  other vias: 84,28
N$50  (via drill 0.3)
  other vias: 78,28
N$51  (via drill 0.3)
  other vias: 78,4
N$52  (via drill 0.3)
  other vias: 45.8,17.3
N$53  (via drill 0.3)
  other vias: 8,4
N$54  (via drill 0.3)
  other vias: 16.1,20.9
N$55  (via drill 0.3)
  other vias: 36,42
N$56  (via drill 0.3)
  other vias: 40,36
SIM_CLK
  Bottom 0.254: IC2.32 50.68,41.52 49.4,42.8 47.35,42.8 R12.1
SIM_CTS  (via drill 0.3)
  Top 0.254: R4.1 v52,24 | v19.5,30 19.5,29.26 IC3.26
  Bottom 0.254: v52,24 42.9,24 34.6,32.3 20.8,32.3 19.5,31 v19.5,30
SIM_DATA
  Bottom 0.254: IC2.31 52.16,40.5 50.7,40.5 49.85,41.35 R13.2 R15.1 45.35,41.35 45,41 45,37.5 45.5,37 45.85,37 C21.1
SIM_DCD
  Top 0.254: R2.1 42.5,20 38,15.5 36.5,15.5 31,10 20,10 16,14 16,19.38 IC3.41
SIM_NETLIGHT  (via drill 0.3)
  Top 0.254: v77,44 R20.2
  Bottom 0.254: IC2.52 76.52,43.52 v77,44
SIM_PRE  (via drill 0.3)
  Top 0.254: R10.1 58.63,31.85 J3.CD@1 56.23,42.27 v55,43.5
  Bottom 0.254: v55,43.5 52.2,43.5 IC2.34
SIM_PWR  (via drill 0.3)
  Top 0.254: v37,17.5 30.5,11.5 20,11.5 17,14.5 17,19.67 IC3.42
  Bottom 0.254: IC2.1 71.43,21.93 68.5,19 38.5,19 v37,17.5
SIM_RST
  Bottom 0.254: IC2.33 52.02,42.52 52,42.5 50.65,42.5 R11.1
SIM_RTS  (via drill 0.3)
  Top 0.254: R3.1 v52,25.5 | v18,29 19.05,29 IC3.27
  Bottom 0.254: v52,25.5 43,25.5 35.5,33 20,33 18,31 v18,29
SIM_RX  (via drill 0.3)
  Top 0.254: IC3.21 25.5,29.59 v25.5,31.3 | v33.5,31.5 41.15,31.5 R5.1
  Bottom 0.254: v25.5,31.3 25.7,31.5 v33.5,31.5
SIM_STATUS
  Top 0.254: IC3.43 18,19.97 18,15.5 21,12.5 29.5,12.5 39.5,21.5 63.5,21.5 67,25 R7.1
SIM_TX  (via drill 0.3)
  Top 0.254: IC3.22 24.8,29.59 v24.8,30.4 | v37,28.5 42.5,23 R1.1
  Bottom 0.254: v24.8,30.4 27.7,28.5 v37,28.5
SIM_VDD  (via drill 0.3)
  Top 0.305: J3.VCC 46,31.79 v46,38
  Bottom 0.254: R15.2 46.2,39.65 C20.2 49.05,36.85 50.3,38.1 50.3,38.8 51,39.5 52.16,39.5 IC2.30
  Bottom 0.305: v46,38 R15.2
SIM_VDD_EXT  (via drill 0.3)
  Top 0.254: R10.2 62.5,29 v62,28.5
  Bottom 0.254: v62,28.5 58.5,28.5 57.5,27.5 57.5,24.34 IC2.15
SWD_CLK
  Top 0.254: IC3.37 15,21.21 15,13.35 R23.1 19.08,9.27 JP2.3
SWD_IO  (via drill 0.3)
  Top 0.254: JP2.2 15.5,6.54 15.5,10 14.15,11.35 R22.1 14,16.5 v13.5,17 | IC3.34 15.61,27.5 v14.5,27.5
  Bottom 0.254: v14.5,27.5 13.5,26.5 v13.5,17
TF_CLK  (via drill 0.3)
  Top 0.254: IC3.15 28.5,28.34 v28.5,34.5 | v24,37.5 24.13,37.63 U$1.5
  Bottom 0.254: v24,37.5 24,37 25.5,35.5 28,35.5 28.5,35 v28.5,34.5
TF_CS
  Top 0.254: U$1.2 27.43,37.07 29.5,35 29.5,28.64 IC3.14
TF_MISO  (via drill 0.3)
  Top 0.254: IC3.16 27.5,28.05 v27.5,34 | 22,39.23 U$1.7 21.93,37.57 v22,37.5
  Bottom 0.254: v22,37.5 25.5,34 v27.5,34
TF_MOSI
  Top 0.254: IC3.17 26.33,27.59 U$1.3
USART1_CTS  (via drill 0.3)  (1 unrouted)
  Top 0.254: IC3.32 14.5,30.02 v14.5,33.5
  Bottom 0.254: v14.5,33.5 14.5,40 13.18,41.33
USART1_RTS  (via drill 0.3)  (1 unrouted)
  Top 0.254: IC3.33 13.5,30.31 v13.5,31
  Bottom 0.254: v13.5,31 16,33.5 16,40 14.45,41.55
USART1_RX  (via drill 0.3)
  Top 0.254: v12,39.5 15.5,36 15.5,29.73 IC3.31
  Bottom 0.254: U1.12 10.63,40.87 v12,39.5
USART1_TX  (via drill 0.3)
  Top 0.254: v13.5,39.5 16.5,36.5 16.5,29.43 IC3.30
  Bottom 0.254: U1.11 11.9,41.09 v13.5,39.5
VCC  (via drill 0.3)
  Top 0.254: C8.1 R8.1 36.85,7.35 42,12.5
  Top 1.016: 42,12.5 42,12.25 | v42,15 63,15 70.5,22.5 v70.5,38.5 v70.5,39.5 v70.5,40.5
  Top 1.676: v42,15 v42,14 v42,13 42,12.5 | 42,12.25 C11.+
  Bottom 0.406: U2.3 37.95,1.55 37.5,2 37.5,3 37.95,3.45 U2.1
  Bottom 0.61: U2.1 41.95,6.6 L1.P$2
  Bottom 0.813: IC2.55 IC2.56 IC2.57 | IC2.55 77.87,40.52 C19.1 C18.1 82.95,40.65 C16.P$1 | v70.5,40.5 74.66,40.5 IC2.55 | v70.5,39.5 73.5,39.5 | v70.5,38.5 73.5,38.5
  Bottom 1.016: 41.95,14.95 v42,15
  Bottom 1.676: L1.P$2 41.95,14.95